# EAGLE design Battery_Indicator (EAGLE 9.2.2)
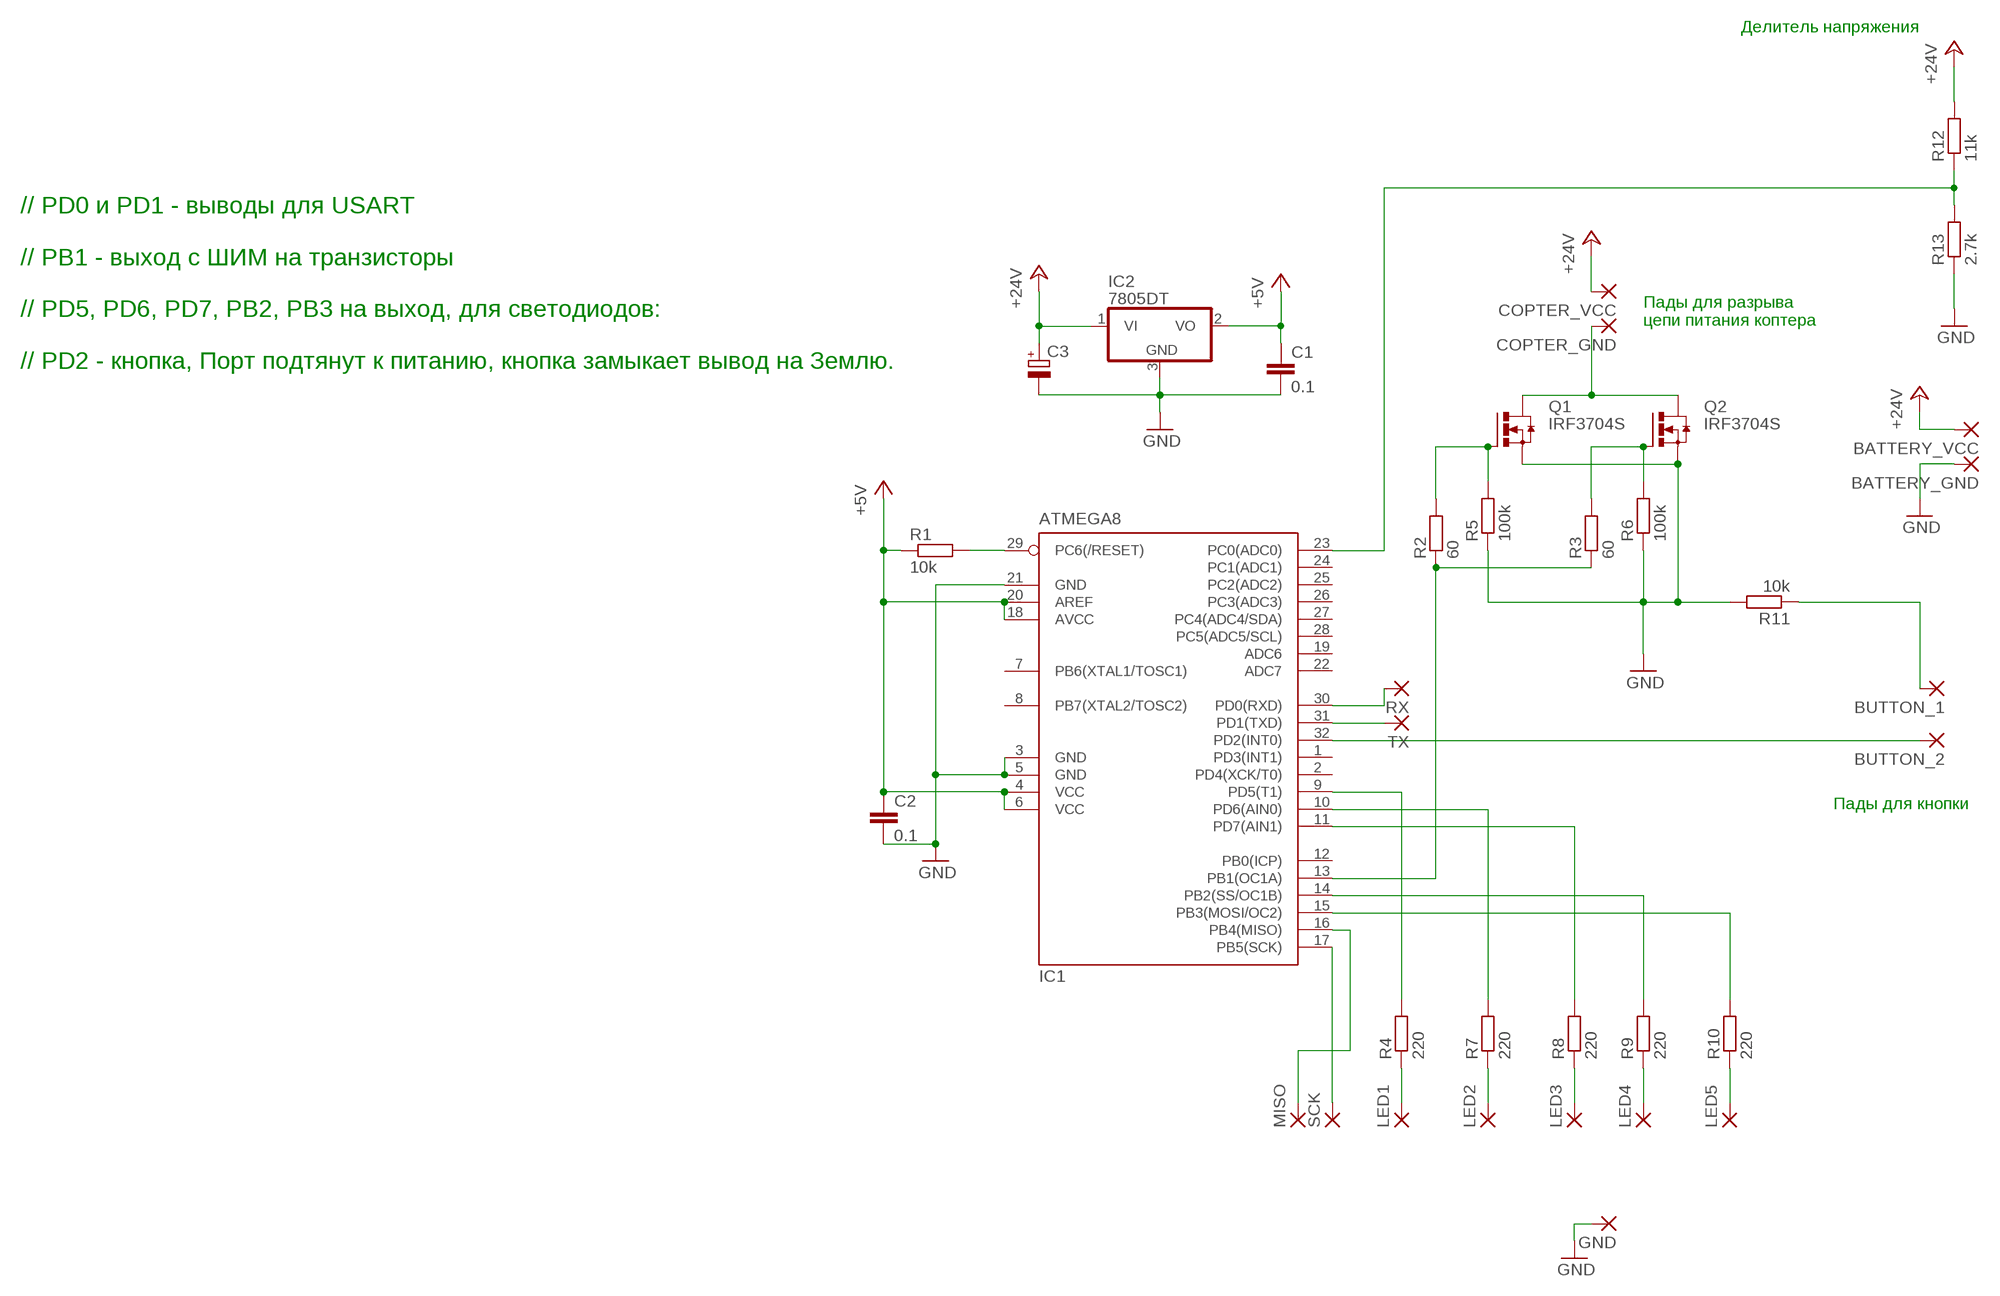
[diagram p0: schematic, sheet 1]

## Parts
BATTERY_GND  3,81/1,4  [3,81/1,4]
BATTERY_VCC  3,81/1,4  [3,81/1,4]
BUTTON_1  SMD2  [SMD1,27-2,54]
BUTTON_2  SMD2  [SMD1,27-2,54]
C1  0.1  C-EUC0805  [C0805]
C2  0.1  C-EUC0805  [C0805]
C3  CPOL-EUSMCD  [SMC_D]
COPTER_GND  3,81/1,4  [3,81/1,4]
COPTER_VCC  3,81/1,4  [3,81/1,4]
GND  SMD2  [SMD1,27-2,54]
IC1  ATMEGA8  MEGA8-AI  [TQFP32-08]
IC2  7805DT  [TO252]
LED1  SMD2  [SMD1,27-2,54]
LED2  SMD2  [SMD1,27-2,54]
LED3  SMD2  [SMD1,27-2,54]
LED4  SMD2  [SMD1,27-2,54]
LED5  SMD2  [SMD1,27-2,54]
MISO  SMD2  [SMD1,27-2,54]
Q1  IRF3704S  [D2PACK]
Q2  IRF3704S  [D2PACK]
R1  10k  R-EU_R0805  [R0805]
R2  60  R-EU_R0805  [R0805]
R3  60  R-EU_R0805  [R0805]
R4  220  R-EU_R0805  [R0805]
R5  100k  R-EU_R0805  [R0805]
R6  100k  R-EU_R0805  [R0805]
R7  220  R-EU_R0805  [R0805]
R8  220  R-EU_R0805  [R0805]
R9  220  R-EU_R0805  [R0805]
R10  220  R-EU_R0805  [R0805]
R11  10k  R-EU_R0805  [R0805]
R12  11k  R-EU_R0805  [R0805]
R13  2.7k  R-EU_R0805  [R0805]
RX  SMD2  [SMD1,27-2,54]
SCK  SMD2  [SMD1,27-2,54]
TX  SMD2  [SMD1,27-2,54]

## Nets
+5V: C1.1 C2.1 IC1.4(VCC) IC1.6(VCC) IC1.18(AVCC) IC1.20(AREF) IC2.2(VO) R1.1
+24V: BATTERY_VCC.1(P) C3.+ COPTER_VCC.1(P) IC2.1(VI) R12.2
GND: BATTERY_GND.1(P) C1.2 C2.2 C3.- GND.1(P) IC1.3(GND) IC1.5(GND) IC1.21(GND) IC2.3(GND) Q1.3(S) Q2.3(S) R5.1 R6.1 R11.2 R13.1
N$1: IC1.9(PD5(T1)) R4.2
N$2: Q1.1(G) R2.2 R5.2
N$3: IC1.29(PC6(/RESET)) R1.2
N$4: Q2.1(G) R3.2 R6.2
N$5: COPTER_GND.1(P) Q1.2(D) Q2.2(D)
N$6: IC1.13(PB1(OC1A)) R2.1 R3.1
N$7: LED1.1(P) R4.1
N$8: LED2.1(P) R7.1
N$9: LED3.1(P) R8.1
N$10: LED4.1(P) R9.1
N$11: LED5.1(P) R10.1
N$12: BUTTON_1.1(P) R11.1
N$13: IC1.10(PD6(AIN0)) R7.2
N$14: IC1.11(PD7(AIN1)) R8.2
N$15: IC1.14(PB2(SS/OC1B)) R9.2
N$16: IC1.15(PB3(MOSI/OC2)) R10.2
N$17: IC1.30(PD0(RXD)) RX.1(P)
N$18: BUTTON_2.1(P) IC1.32(PD2(INT0))
N$19: IC1.23(PC0(ADC0)) R12.1 R13.2
N$20: IC1.31(PD1(TXD)) TX.1(P)
N$25: IC1.16(PB4(MISO)) MISO.1(P)
N$26: IC1.17(PB5(SCK)) SCK.1(P)
Unconnected: IC1.1(PD3(INT1)) IC1.2(PD4(XCK/T0)) IC1.7(PB6(XTAL1/TOSC1)) IC1.8(PB7(XTAL2/TOSC2)) IC1.12(PB0(ICP)) IC1.19(ADC6) IC1.22(ADC7) IC1.24(PC1(ADC1)) IC1.25(PC2(ADC2)) IC1.26(PC3(ADC3)) IC1.27(PC4(ADC4/SDA)) IC1.28(PC5(ADC5/SCL))

## Notes on the sheet
- Делитель напряжения
- Пады для разрыва
  цепи питания коптера
- // PD0 и PD1 - выводы для USART
  
  // PB1 - выход с ШИМ на транзисторы
  
  // PD5, PD6, PD7, PB2, PB3 на выход, для светодиодов:
  
  // PD2 - кнопка, Порт подтянут к питанию, кнопка замыкает вывод на Землю.
- Пады для кнопки

## Library data of the parts
BATTERY_GND BATTERY_VCC COPTER_GND COPTER_VCC = wirepad:3,81/1,4: THROUGH-HOLE PAD
BUTTON_1 BUTTON_2 GND LED1-LED5 MISO RX SCK TX = wirepad:SMD2: SMD PAD
C1 C2 = rcl:C-EU: CAPACITOR, European symbol; SPICEPREFIX: C
C3 = rcl:CPOL-EU: POLARIZED CAPACITOR, European symbol; SPICEPREFIX: C
IC1 = atmel:MEGA8: MICROCONTROLLER 8 Kbytes FLASH, 1 kbytes SRAM, 512 bytes EEPROM, USART, 6-channel 10 bit ADC, 2-channel 8 bit ADC Pin compatible with Atmega48, ATMega88, ATMega168 Source: avr.lbr; MPN: ATMEGA8-16AU; OC_FARNELL: 9171371; OC_NEWARK: 73M8863
IC2 = linear:78*: Positive VOLTAGE REGULATOR Source: http://cache.national.com/ds/LM/LM78L05.pdf http://www.fairchildsemi.com/ds/LM/LM7805.pdf
Q1 Q2 = transistor-power:IRF3704: SMPS MOSFET HEXFET® Power MOSFET Source: http://www.irf.com/product-info/datasheets/data/irf3704.pdf
R1-R13 = rcl:R-EU_: RESISTOR, European symbol; SPICEPREFIX: R

## Board
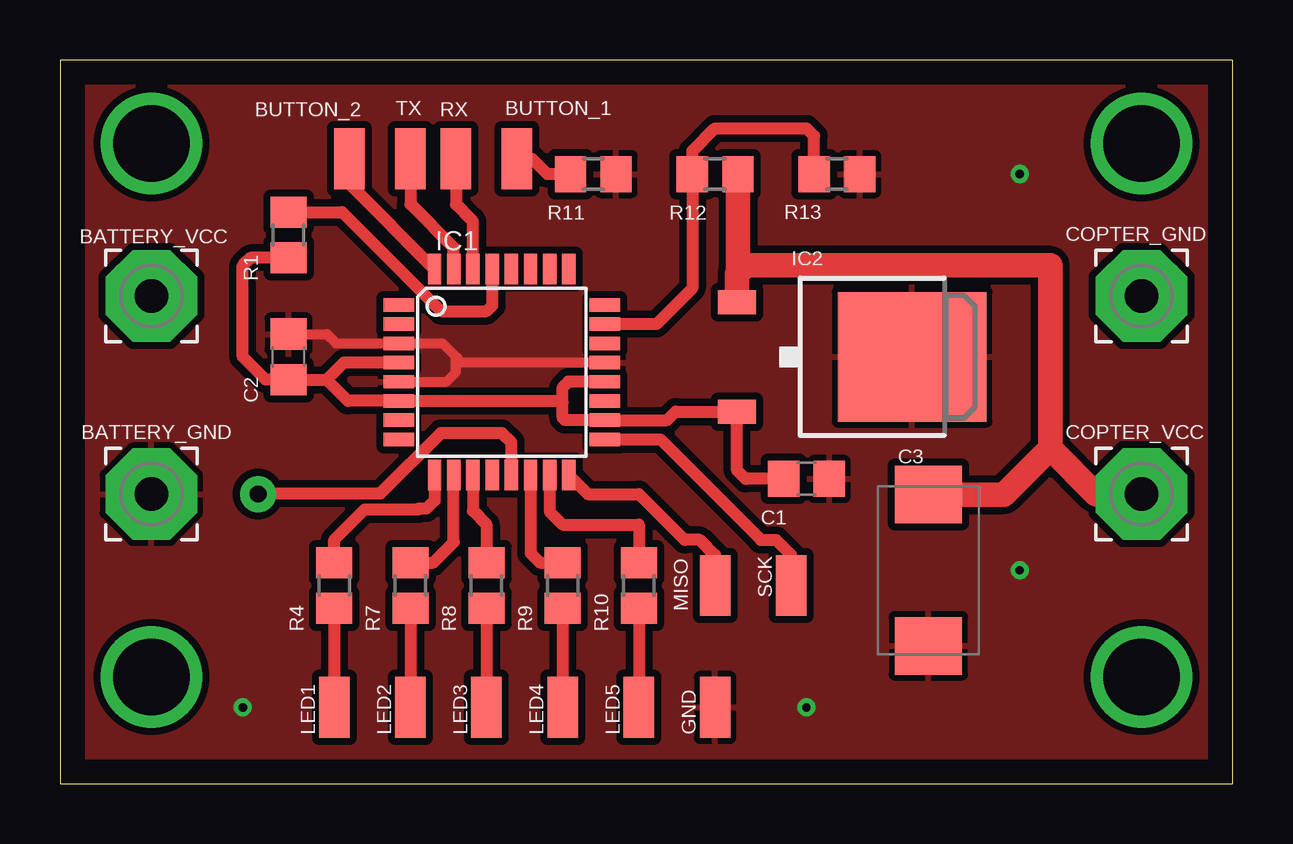
[diagram p1: board, top side]
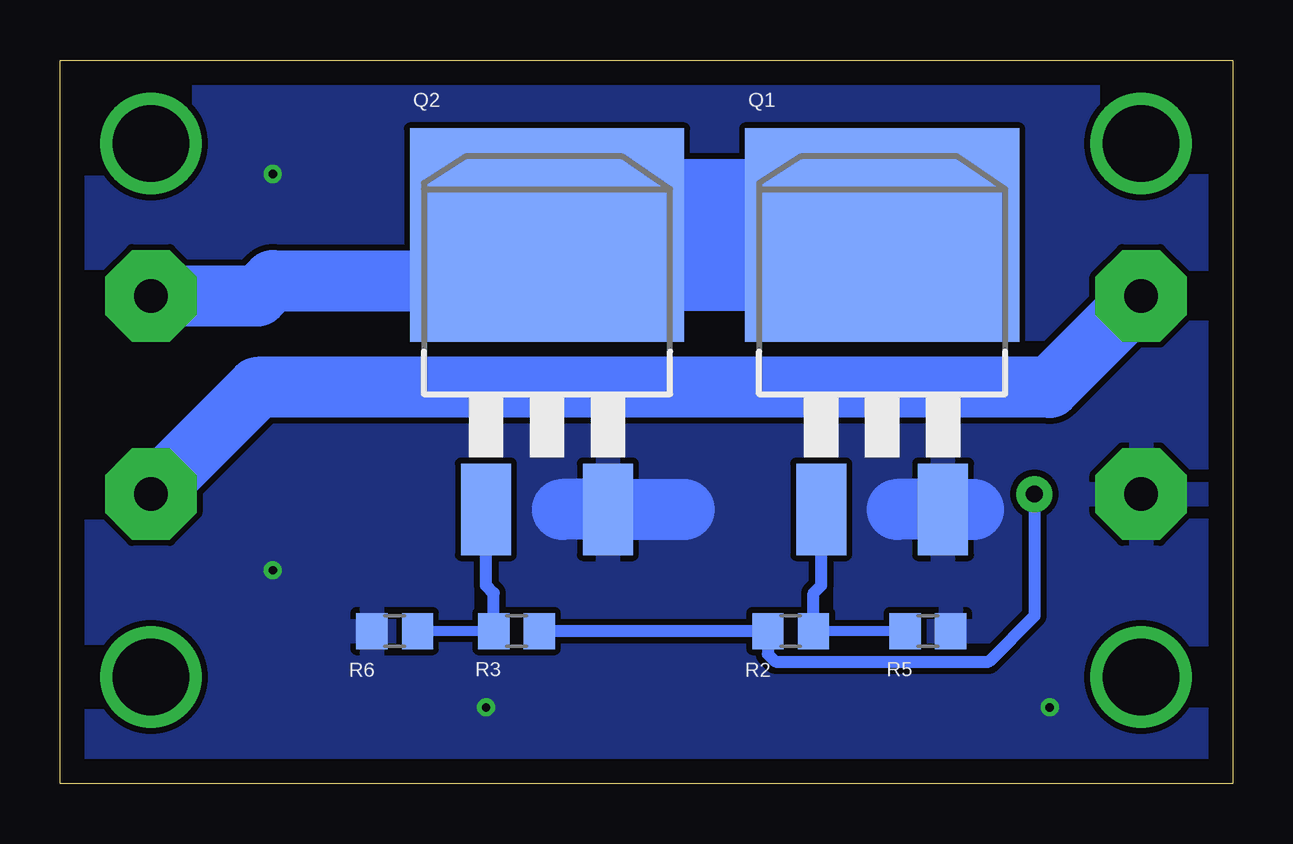
[diagram p2: board, bottom side, seen from below]

Size 48.88 x 30.15 mm. Coordinates in mm from the lower left corner, seen from the top.
Outline: 0,0 48.88,0 48.88,30.15 0,30.15 0,0
Copper layers (1*16): Top 0.035mm / dielectric 1.5mm / Bottom 0.035mm
Design rules "default": minimum track width 6mil, minimum drill 0.35mm, track to track 6mil, track to pad 6mil, pad to pad 6mil, via to via 6mil, smd to smd 6mil, copper to edge 40mil, drill to drill 6mil, minimum pad ring 10mil, minimum via ring 8mil, stop-mask expansion 4mil, vias tented up to drill 0mil, thermal gap 10mil

### Footprints (pad centres in the part's own frame; a part is rotated, then mirrored left to right if it is on the bottom)
3,81/1,4 = drill 1.397 pad 3.81 octagon: 1 0,0
SMD1,27-2,54 = smd 1.27 x 2.54: 1 0,0
C0805 = smd 1.3 x 1.5: 1 -0.95,0; 2 0.95,0
SMC_D = smd 2.4 x 2.8: + -3.15,0; - 3.15,0
TQFP32-08 = smd 1.27 x 0.559: 1 -4.293,2.8; 2 -4.293,2; 3 -4.293,1.2; 4 -4.293,0.4; 5 -4.293,-0.4; 6 -4.293,-1.2; 7 -4.293,-2; 8 -4.293,-2.8; 17 4.293,-2.8; 18 4.293,-2; 19 4.293,-1.2; 20 4.293,-0.4; 21 4.293,0.4; 22 4.293,1.2; 23 4.293,2; 24 4.293,2.8 | smd 0.559 x 1.27: 9 -2.8,-4.293; 10 -2,-4.293; 11 -1.2,-4.293; 12 -0.4,-4.293; 13 0.4,-4.293; 14 1.2,-4.293; 15 2,-4.293; 16 2.8,-4.293; 25 2.8,4.293; 26 2,4.293; 27 1.2,4.293; 28 0.4,4.293; 29 -0.4,4.293; 30 -1.2,4.293; 31 -2,4.293; 32 -2.8,4.293
TO252 = smd 1 x 1.6: 1 -2.28,-4.8; 2 2.28,-4.8 | smd 5.4 x 6.2: 3 0,2.5
D2PACK = smd 2.083 x 3.81: 1 -2.54,-8.89; 3 2.54,-8.89 | smd 11.43 x 8.89: 2 0,2.54
R0805 = smd 1.3 x 1.5: 1 -0.95,0; 2 0.95,0

### Placement (x,y rotation side)
BATTERY_GND  3.81,12.06 0 top
BATTERY_VCC  3.81,20.32 90 top
BUTTON_1  19.05,26.03 0 top
BUTTON_2  12.06,26.03 0 top
C1  31.12,12.7 0 top
C2  9.52,17.78 90 top
C3  36.2,8.89 270 top
COPTER_GND  45.09,20.32 0 top
COPTER_VCC  45.09,12.06 0 top
GND  27.3,3.17 0 top
IC1  18.41,17.14 0 top
IC2  33.02,17.78 270 top
LED1  11.43,3.17 0 top
LED2  14.61,3.17 0 top
LED3  17.78,3.17 0 top
LED4  20.95,3.17 0 top
LED5  24.13,3.17 0 top
MISO  27.3,8.25 0 top
Q1  14.61,20.32 0 bottom
Q2  28.57,20.32 0 bottom
R1  9.52,22.86 90 top
R2  18.41,6.35 0 bottom
R3  29.84,6.35 180 bottom
R4  11.43,8.25 90 top
R5  12.7,6.35 180 bottom
R6  34.92,6.35 0 bottom
R7  14.61,8.25 90 top
R8  17.78,8.25 90 top
R9  20.95,8.25 90 top
R10  24.13,8.25 90 top
R11  22.23,25.4 0 top
R12  27.3,25.4 0 top
R13  32.38,25.4 180 top
RX  16.51,26.03 0 top
SCK  30.48,8.25 0 top
TX  14.61,26.03 0 top

### Tracks (layer width: path | path; a pad name or v marks a point on that pad's centre or on a via)
+5V
  Top 0.508: R1.1 7.94,21.91 7.62,21.59 7.62,17.78 8.57,16.83 C2.1 11.11,16.83 | IC1.20 21.19,16.74 20.95,16.51 20.95,15.88 | 20.95,15.88 20.95,15.24 21.05,15.14 IC1.18 25.3,15.14 25.66,15.5 IC2.2 28.22,13.05 28.57,12.7 C1.1 | 20.95,15.88 20.88,15.94 IC1.6 11.99,15.94 11.11,16.83 | IC1.4 11.82,17.55 11.11,16.83
+24V
  Top 1.016: IC2.1 28.22,21.23 28.26,21.27 | R12.2 28.26,21.27 | COPTER_VCC.1 43.18,12.06 41.27,13.97 | 41.27,13.97 41.27,21.59 28.57,21.59 28.26,21.27 | C3.+ 39.34,12.04 41.27,13.97
  Bottom 2.54: BATTERY_VCC.1 7.62,16.51 40.64,16.51 COPTER_VCC.1
GND  (via drill 0.35)
  Top 0.406: IC1.5 16.11,16.74 16.51,17.14 16.51,17.78 | 16.51,17.78 15.95,18.34 IC1.3 11.5,18.34 11.11,18.73 C2.2 | IC1.21 16.74,17.55 16.51,17.78
  Bottom 2.54: 13.97,11.43 Q1.3 10.79,11.43 | 22.86,11.43 Q2.3 27.94,11.43
  other vias: 40.01,8.89 31.12,3.17 7.62,3.17 40.01,25.4
  pour Top (isolate 0.305): -1.27,31.75 -1.27,-1.27 50.16,-1.27 50.16,31.75
  pour Bottom (isolate 0.254): -1.27,32.38 51.43,32.38 51.43,-2.54 -1.27,-2.54
N$1
  Top 0.508: IC1.9 15.61,11.8 15.27,11.45 14.97,11.45 14.94,11.43 12.7,11.43 11.43,10.16 R4.2
N$2
  Bottom 0.406: R5.2 R2.2
  Bottom 0.508: Q1.1 17.14,8.25 17.46,7.94 R2.2
N$3
  Top 0.508: IC1.29 18.02,19.92 17.78,19.69 15.88,19.69 11.75,23.81 R1.2
N$4
  Bottom 0.406: R3.2 R6.2
  Bottom 0.508: R3.2 30.8,7.94 31.12,8.25 Q2.1
N$5
  Bottom 0.508: Q2.2 29.18,23.47 29.18,23.67
  Bottom 2.54: Q1.2 24.61,22.86 25.43,23.67 27.94,23.67 | 27.94,23.67 29.18,23.67 | 27.94,23.67 27.94,23.49 | 27.94,23.49 Q2.2 26.67,24.77 16.51,24.77 Q1.2 | Q1.2 17.78,22.86 19.69,20.95 26.03,20.95 27.94,22.86 27.94,23.49 | COPTER_GND.1 40.64,20.32 40.01,20.95 31.7,20.95 29.18,23.47
N$6  (via drill 0.7 pad 1.5)
  Top 0.508: IC1.13 18.81,14.2 18.41,14.61 15.88,14.61 13.36,12.09 8.28,12.09 v8.25,12.06
  Bottom 0.508: v8.25,12.06 8.25,6.98 10.16,5.08 19.05,5.08 19.37,5.39 R2.1 R3.1
N$7
  Top 0.508: R4.1 LED1.1
N$8
  Top 0.508: R7.1 LED2.1
N$9
  Top 0.508: R8.1 LED3.1
N$10
  Top 0.508: R9.1 LED4.1
N$11
  Top 0.508: R10.1 LED5.1
N$12
  Top 0.508: R11.1 20.32,25.4 19.69,26.03 BUTTON_1.1
N$13
  Top 0.508: IC1.10 16.41,10.06 15.55,9.2 R7.2
N$14
  Top 0.508: IC1.11 17.21,11.36 17.78,10.8 R8.2
N$15
  Top 0.508: IC1.14 19.62,9.59 20.01,9.2 R9.2
N$16
  Top 0.508: R10.2 24.13,10.8 20.95,10.8 20.41,11.33 IC1.15
N$17
  Top 0.508: IC1.30 17.21,23.42 17.14,23.49 16.51,24.13 RX.1
N$18
  Top 0.508: IC1.32 12.06,24.99 BUTTON_2.1
N$19
  Top 0.508: R13.2 31.44,26.98 31.12,27.3 27.3,27.3 26.35,26.36 R12.1 26.35,20.64 24.86,19.14 IC1.23
N$20
  Top 0.508: IC1.31 16.41,22.32 14.61,24.13 TX.1
N$21  (via drill 3.2)
  other vias: 3.81,26.67
N$22  (via drill 3.2)
  other vias: 3.81,4.44
N$23  (via drill 3.2)
  other vias: 45.09,26.67
N$24  (via drill 3.2)
  other vias: 45.09,4.44
N$25
  Top 0.508: IC1.16 22,12.06 24.13,12.06 26.03,10.16 26.67,10.16 27.3,9.52 MISO.1
N$26
  Top 0.508: IC1.17 25.02,14.34 29.21,10.16 29.84,10.16 30.48,9.52 SCK.1